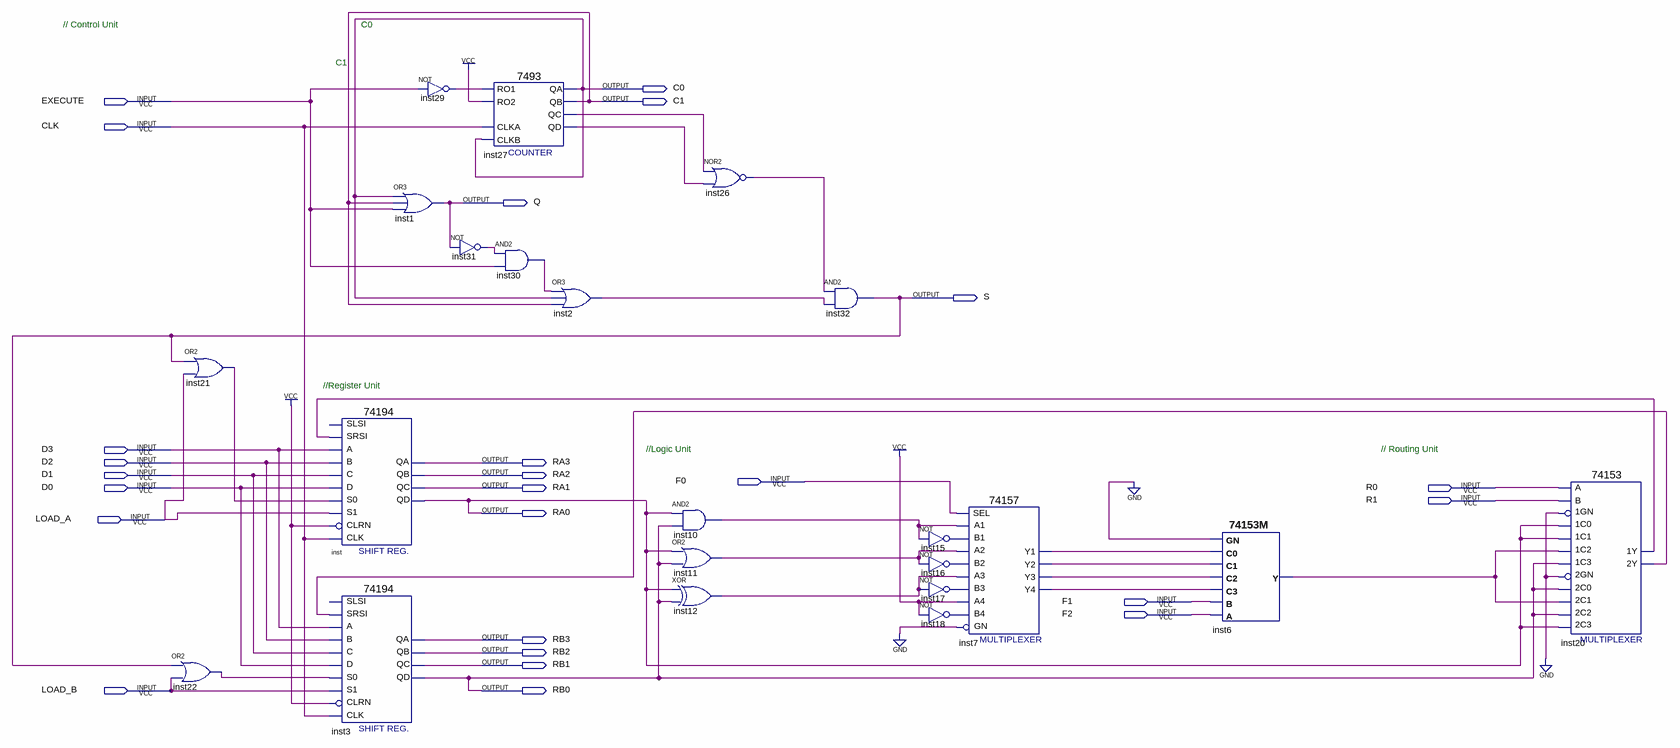
[diagram p0: schematic sheet]
// Quartus schematic lucky_3.bdf as structural Verilog: 22 symbols, 25 pins
module lucky_3 (
  input  EXECUTE,
  input  CLK,
  input  D3,
  input  D2,
  input  D1,
  input  F0,
  input  D0,
  input  R0,
  input  R1,
  input  LOAD_A,
  input  F1,
  input  F2,
  input  LOAD_B,
  output C0,
  output C1,
  output Q,
  output S,
  output RA3,
  output RA2,
  output RA1,
  output RA0,
  output RB3,
  output RB2,
  output RB1,
  output RB0
);

  wire inst2_out, inst6_y, inst7_y1, inst7_y2, inst7_y3, inst7_y4, inst10_out, inst11_out, inst12_out,
       inst15_out, inst16_out, inst17_out, inst18_out, inst20_1y, inst20_2y, inst21_out, inst22_out,
       inst26_out, inst27_qc, inst27_qd, inst29_out, inst30_out, inst31_out;

  or inst22 (inst22_out, S, LOAD_B);
  or inst21 (inst21_out, S, LOAD_A);
  \74194  inst (
    .SRSI(inst20_1y), .B(D2), .C(D1), .CLK(CLK), .CLRN(1'b1), .D(D0), .S1(LOAD_A), .S0(inst21_out), .A(D3),
    .QA(RA3), .QB(RA2), .QC(RA1), .QD(RA0));  // open: SLSI
  \74194  inst3 (
    .SRSI(inst20_2y), .B(D2), .C(D1), .CLK(CLK), .CLRN(1'b1), .D(D0), .S1(LOAD_B), .S0(inst22_out), .A(D3),
    .QA(RB3), .QB(RB2), .QC(RB1), .QD(RB0));  // open: SLSI
  not inst29 (inst29_out, EXECUTE);
  or inst1 (Q, C0, C1, EXECUTE);
  not inst31 (inst31_out, Q);
  \7493  inst27 (.RO1(inst29_out), .RO2(1'b1), .CLKA(CLK), .CLKB(C0), .QC(inst27_qc), .QB(C1), .QA(C0), .QD(inst27_qd));
  and inst30 (inst30_out, inst31_out, EXECUTE);
  or inst2 (inst2_out, inst30_out, C0, C1);
  and inst10 (inst10_out, RA0, RB0);
  or inst11 (inst11_out, RA0, RB0);
  xor inst12 (inst12_out, RA0, RB0);
  nor inst26 (inst26_out, inst27_qc, inst27_qd);
  and inst32 (S, inst26_out, inst2_out);
  not inst15 (inst15_out, inst10_out);
  not inst16 (inst16_out, inst11_out);
  not inst17 (inst17_out, inst12_out);
  not inst18 (inst18_out, 1'b1);
  \74157  inst7 (
    .A1(inst10_out), .B1(inst15_out), .SEL(F0), .B2(inst16_out), .A3(inst12_out), .B3(inst17_out),
    .A2(inst11_out), .B4(inst18_out), .GN(1'b0), .A4(1'b1), .Y2(inst7_y2), .Y1(inst7_y1), .Y4(inst7_y4),
    .Y3(inst7_y3));
  \74153M  inst6 (.A(F2), .B(F1), .C3(inst7_y4), .C2(inst7_y3), .C1(inst7_y2), .C0(inst7_y1), .GN(1'b0), .Y(inst6_y));
  \74153  inst20 (
    .\1C1 (RA0), .\1GN (1'b0), .\1C0 (RA0), .\2C0 (RB0), .\2GN (1'b0), .\2C2 (RB0), .\1C2 (inst6_y),
    .\1C3 (RB0), .B(R1), .A(R0), .\2C1 (inst6_y), .\2C3 (RA0), .\1Y (inst20_1y), .\2Y (inst20_2y));

  // Notes on the sheet:
  //   // Control Unit
  //   C0
  //   C1
  //   //Register Unit
  //   //Logic Unit
  //   // Routing Unit
endmodule
